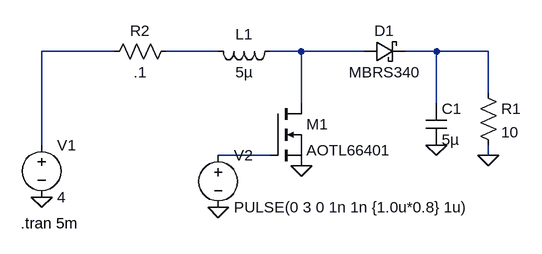
[diagram p0: schematic booster.asc]
booster.asc, the LTspice schematic file:
Version 4
SHEET 1 880 680
WIRE 80 0 -32 0
WIRE 240 0 160 0
WIRE 368 0 320 0
WIRE 464 0 368 0
WIRE 576 0 528 0
WIRE 656 0 576 0
WIRE 656 64 656 0
WIRE 368 80 368 0
WIRE 576 80 576 0
WIRE -32 144 -32 0
WIRE 320 160 240 160
WIRE 656 160 656 144
FLAG -32 224 0
FLAG 368 176 0
FLAG 240 240 0
FLAG 656 160 0
FLAG 576 144 0
SYMBOL voltage -32 128 R0
WINDOW 123 0 0 Left 0
WINDOW 39 0 0 Left 0
SYMATTR InstName V1
SYMATTR Value 4
SYMBOL ind 336 -16 R90
WINDOW 0 5 56 VBottom 2
WINDOW 3 32 56 VTop 2
SYMATTR InstName L1
SYMATTR Value 5µ
SYMATTR SpiceLine Ipk=60 Rser=0.00000 Rpar=29 Cpar=3.01p
SYMBOL nmos 320 80 R0
SYMATTR InstName M1
SYMATTR Value AOTL66401
SYMBOL voltage 240 144 R0
WINDOW 123 0 0 Left 0
WINDOW 39 0 0 Left 0
SYMATTR InstName V2
SYMATTR Value PULSE(0 3 0 1n 1n {1.0u*0.8} 1u)
SYMBOL schottky 464 16 R270
WINDOW 0 32 32 VTop 2
WINDOW 3 0 32 VBottom 2
SYMATTR InstName D1
SYMATTR Value MBRS340
SYMATTR Description Diode
SYMATTR Type diode
SYMBOL res 640 48 R0
SYMATTR InstName R1
SYMATTR Value 10
SYMBOL cap 560 80 R0
SYMATTR InstName C1
SYMATTR Value 5µ
SYMBOL res 176 -16 R90
WINDOW 0 0 56 VBottom 2
WINDOW 3 32 56 VTop 2
SYMATTR InstName R2
SYMATTR Value .1
TEXT -64 264 Left 2 !.tran 5m

The netlist it stands for:
* booster.asc
V1 N001 0 4
L1 N003 N002 5µ Ipk=60 Rser=0.00000 Rpar=29 Cpar=3.01p
M1 N003 N005 0 0 AOTL66401
V2 N005 0 PULSE(0 3 0 1n 1n {1.0u*0.8} 1u)
D1 N003 N004 MBRS340
R1 N004 0 10
C1 N004 0 5µ
R2 N002 N001 .1
.model D D
.lib standard.dio
.model NMOS NMOS
.model PMOS PMOS
.lib standard.mos
.tran 5m
.backanno
.end